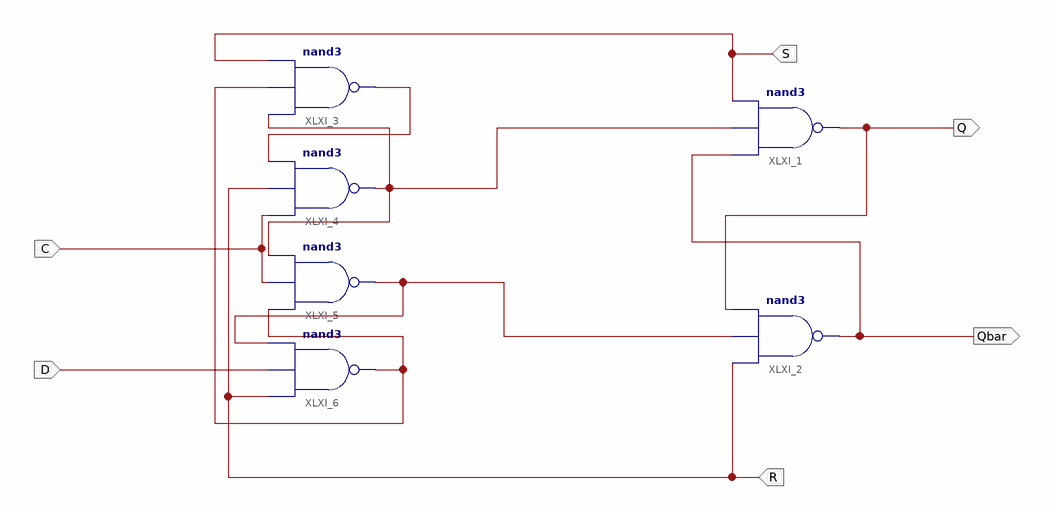
[diagram p0: schematic sheet 1]
// Xilinx ISE schematic D_FLIPFLOP.sch (kintex7) as structural Verilog: 6 symbols, 6 ports
module D_FLIPFLOP (
  input  R,
  input  D,
  input  C,
  input  S,
  output Q,
  output Qbar
);

  wire XLXN_8, XLXN_9, XLXN_12, XLXN_14;

  nand XLXI_1 (Q, Qbar, XLXN_9, S);
  nand XLXI_2 (Qbar, R, XLXN_12, Q);
  nand XLXI_3 (XLXN_8, XLXN_9, XLXN_14, S);
  nand XLXI_4 (XLXN_9, C, R, XLXN_8);
  nand XLXI_5 (XLXN_12, XLXN_14, C, XLXN_9);
  nand XLXI_6 (XLXN_14, R, D, XLXN_12);
endmodule
